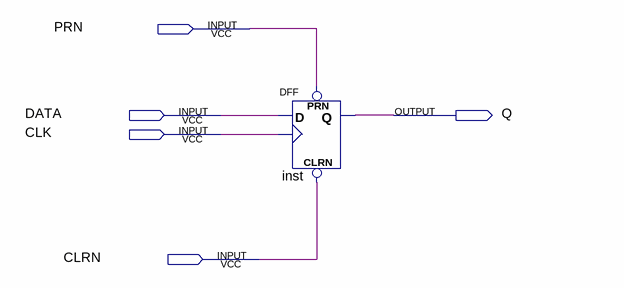
[diagram p0: schematic sheet]
// Quartus schematic test1.bdf as structural Verilog: 1 symbols, 5 pins
module test1 (
  input  PRN,
  input  DATA,
  input  CLK,
  input  CLRN,
  output Q
);

  DFF inst (.CLRN(CLRN), .CLK(CLK), .D(DATA), .PRN(PRN), .Q(Q));
endmodule
